# Altium project Bass Debug Board.PrjPcb
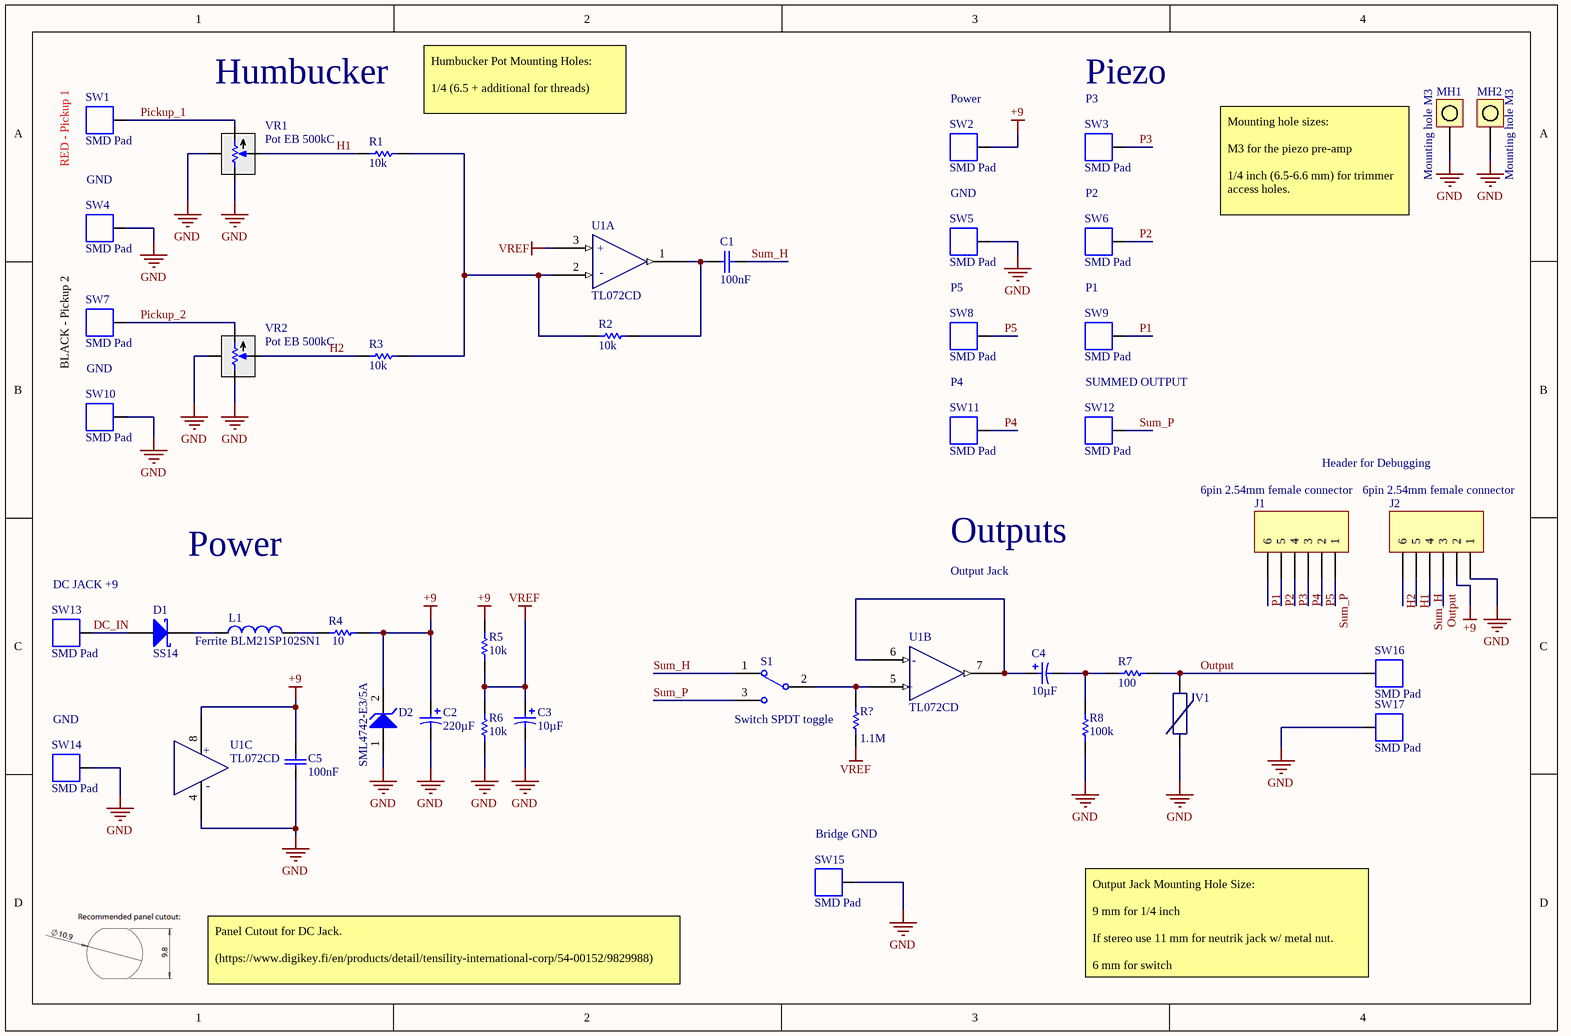
[diagram p0: Bass Debug Board.SchDoc]
1 sheet, 43 parts. Net scope: global (net labels, ports and power ports of the same name join across sheets).
Board file: Bass Debug Board.PcbDoc

## Sheet Bass Debug Board.SchDoc
size A4; SheetNumber: 1; SheetTotal: 1

### Parts
C1  Capacitance: 100nF  [1206-CAP]  (hidden comment: Cap 100nF 1206 C0G)
C2  Capacitance: 220µF  [E-CAP, SMT, diameter 6.3mm, height 7.7mm]  (hidden comment: Cap pol 220µF 16V)
C3  Capacitance: 10µF  [E-CAP, SMT, diameter 4mm, height 5.4mm]  (hidden comment: Cap pol 10µF 16V)
C4  Capacitance: 10µF  [E-CAP, SMT, diameter 5mm, height 5.4mm]  (hidden comment: Cap pol 10µF 35V)
C5  Capacitance: 100nF  [1206-CAP]  (hidden comment: Cap 100nF 1206 C0G)
D1  SS14  [SS14]
D2  SML4742-E3/5A  [DO-214AC]
J1  6pin 2.54mm female connector  [Header 1X6]
J2  6pin 2.54mm female connector  [Header 1X6]
L1  Ferrite BLM21SP102SN1  [0805-IND]
MH1  Mounting hole M3  [Mounting hole M3]  (no BOM)
MH2  Mounting hole M3  [Mounting hole M3]  (no BOM)
R1  Resistance: 10k  [0805-RES]  (hidden comment: Res 10k 1% 0805)
R2  Resistance: 10k  [0805-RES]  (hidden comment: Res 10k 1% 0805)
R3  Resistance: 10k  [0805-RES]  (hidden comment: Res 10k 1% 0805)
R4  Resistance: 10  [0805-RES]  (hidden comment: Res 10R 5% 0805)
R5  Resistance: 10k  [0805-RES]  (hidden comment: Res 10k 1% 0805)
R6  Resistance: 10k  [0805-RES]  (hidden comment: Res 10k 1% 0805)
R7  Resistance: 100  [0805-RES]  (hidden comment: Res 100R 1% 0805)
R8  Resistance: 100k  [0603-RES]  (hidden comment: Res 100k 1% 0603)
R?  Resistance: 1.1M  [0402-RES]  (hidden comment: Res 1.1M 1% 0402)
S1  Switch SPDT toggle  [Switch SPDT]
SW1  SMD Pad  [SMD_pad]
SW2  SMD Pad  [SMD_pad]
SW3  SMD Pad  [SMD_pad]
SW4  SMD Pad  [SMD_pad]
SW5  SMD Pad  [SMD_pad]
SW6  SMD Pad  [SMD_pad]
SW7  SMD Pad  [SMD_pad]
SW8  SMD Pad  [SMD_pad]
SW9  SMD Pad  [SMD_pad]
SW10  SMD Pad  [SMD_pad]
SW11  SMD Pad  [SMD_pad]
SW12  SMD Pad  [SMD_pad]
SW13  SMD Pad  [SMD_pad]
SW14  SMD Pad  [SMD_pad]
SW15  SMD Pad  [SMD_pad]
SW16  SMD Pad  [SMD_pad]
SW17  SMD Pad  [SMD_pad]
U1  TL072CD  [SOIC8-127P600X175-8N]  (parts A,B,C of 3)
V1  Var AVRF101U6R8KT242  [0402 COMPONENT]  (value not drawn)
VR1  Pot EB 500kC  [VB16Z]
VR2  Pot EB 500kC  [VB16Z]

### Nets
+9: C2.1 C5.2 D2.2 J2.2 R4.2 R5.1 SW2.1 U1.8(V+)
GND: C2.2 C3.2 C5.1 D2.1 J2.1 MH1.1 MH2.1 R6.2 R8.2 SW4.1 SW5.1 SW10.1 SW14.1 SW15.1 SW17.1 U1.4(V-) V1.1 VR1.1(CCWPIN) VR1.4 VR2.1(CCWPIN) VR2.4
VREF: C3.1 R5.2 R6.1 R?.2 U1.3(IN+)
DC_IN: D1.A SW13.1
H1: J2.5 R1.1 VR1.2(WIPER)
H2: J2.6 R3.1 VR2.2(WIPER)
Output: J2.3 R7.2 SW16.1 V1.2
P1: J1.6 SW9.1
P2: J1.5 SW6.1
P3: J1.4 SW3.1
P4: J1.3 SW11.1
P5: J1.2 SW8.1
Pickup_1: SW1.1 VR1.3(CWPIN)
Pickup_2: SW7.1 VR2.3(CWPIN)
Sum_H: C1.2 J2.4 S1.1
Sum_P: J1.1 S1.3 SW12.1
NetC1_1: C1.1 R2.2 U1.1(OUT)
NetC4_1: C4.1 U1.6(IN-) U1.7
NetC4_2: C4.2 R7.1 R8.1
NetD1_K: D1.K L1.1
NetL1_2: L1.2 R4.1
NetR1_2: R1.2 R2.1 R3.2 U1.2(IN-)
NetR?_1: R?.1 S1.2 U1.5(IN+)

### Notes on the sheet
- Humbucker
- (near R1) Humbucker Pot Mounting Holes:
  1/4 (6.5 + additional for threads)
- (near SW2) Power
- Piezo
- (near SW3) P3
- (near SW1) RED - Pickup 1
- GND
- P2
- (near MH1) Mounting hole sizes:
  M3 for the piezo pre-amp
  1/4 inch (6.5-6.6 mm) for trimmer access holes.
- P5
- P1
- BLACK - Pickup 2
- P4
- SUMMED OUTPUT
- Header for Debugging
- Power
- Outputs
- Output Jack
- DC JACK +9
- (near SW14) GND
- (near SW15) Bridge GND
- Panel Cutout for DC Jack.
  (https://www.digikey.fi/en/products/detail/tensility-international-corp/54-00152/9829988)
- Output Jack Mounting Hole Size:
  9 mm for 1/4 inch
  If stereo use 11 mm for neutrik jack w/ metal nut.
  6 mm for switch
- (in symbol CMP-028-0012-7, part A) +; -
- (in symbol CMP-028-0012-7, part B) -; +
- (in symbol CMP-028-0012-7, part C) +; -

### Library data of the parts
C1 C5 = CMP-04102-2: Cap 100nF 1206 C0G 50V +-5%; Tolerance (+-): 5%; Dielectric: C0G; Height: 1.8mm; Size (Imperial): 1206; Rated Voltage: 50V; Maximum operating temperature: 125°C
C2 = CMP-00098-4: Cap Aluminum 220uF 16V ±20% (6.3x7.7mm) SMD 2000h 85°C; Lifetime @ Max. Temp. (hours): 2000h; Rated Voltage: 16V; Maximum operating temperature: 85°C; - Tolerance: 20%; + Tolerance: 20%
C3 = CMP-00093-4: Cap Aluminum 10uF 16V ±20% (4x5.4mm) SMD 2000h 85°C; Lifetime @ Max. Temp. (hours): 2000h; + Tolerance: 20%; Rated Voltage: 16V; - Tolerance: 20%; Maximum operating temperature: 85°C
C4 = CMP-00115-4: Cap Aluminum 10uF 35V ±20% (5x5.4mm) SMD 2000h 85°C; + Tolerance: 20%; Lifetime @ Max. Temp. (hours): 2000h; Maximum operating temperature: 85°C; Rated Voltage: 35V; - Tolerance: 20%
D1 = CMP-029-0000-5: ON SEMICONDUCTOR - SS14 - DIODE, SCHOTTKY, 1A, 40V, DO-214AC-2; Manufacturer: ON Semiconductor / Fairchild; Forward Voltage: 500mV; Max Forward Surge Current (Ifsm): 40A; Polarity: Standard; Power Dissipation: 1.1W; Element Configuration: Single; Peak Reverse Current: 200uA; Number of Elements: 1; Average Rectified Current: 1A; ComponentLink2URL: https://datasheet.ciiva.com/8303/ss19-8303766.pdf?src-supplier=Avnet; Source: main.SchLib; Mount: Surface Mount; ComponentLink4URL: https://datasheet.ciiva.com/7965/1766303-7965241.pdf?src-supplier=Element14; Termination: SMD/SMT; Height: 2.2mm; Lead Free: Lead Free; Packaging: Tape and Reel; Max Reverse Voltage (DC): 40V; Voltage Rating (DC): 40V; REACH SVHC: No SVHC; ComponentLink7Description: https://datasheet.ciiva.com/910/ss12-910697.pdf?src-supplier=Digi-Key; Current: 1A; Number of Pins: 2; ComponentLink8Description: https://datasheet.ciiva.com/22651/1880990-22651980.pdf?src-supplier=Element14; Radiation Hardening: No; Case/Package: SMA; ComponentLink1URL: https://datasheet.ciiva.com/4713/ss14-197224-4713938.pdf?src-supplier=Mouser; Number of Terminals: 2; ComponentLink6Description: https://datasheet.ciiva.com/25951/ss19-25951496.pdf?src-supplier=Avnet+Europe; Manufacturer Part Number: SS14; ComponentLink1Description: https://datasheet.ciiva.com/4713/ss14-197224-4713938.pdf?src-supplier=Mouser; Forward Current: 1A; Max Repetitive Reverse Voltage (Vrrm): 40V; ComponentLink3URL: https://datasheet.ciiva.com/910/ss12-910695.pdf?src-supplier=Digi-Key; Max Operating Temperature: 125°C; Output Current: 1A; Peak Non-Repetitive Surge Current: 40A; Stock 1: 302709; ComponentLink6URL: https://datasheet.ciiva.com/25951/ss19-25951496.pdf?src-supplier=Avnet+Europe; ComponentLink2Description: https://datasheet.ciiva.com/8303/ss19-8303766.pdf?src-supplier=Avnet; Current Rating: 1A; ComponentLink3Description: https://datasheet.ciiva.com/910/ss12-910695.pdf?src-supplier=Digi-Key; Voltage: 40V; ComponentLink8URL: https://datasheet.ciiva.com/22651/1880990-22651980.pdf?src-supplier=Element14; Pricing 1: 1 = 0,42000, 10 = 0,29400, 50 = 0,29400, 100 = 0,13500, 1000 = 0,10400, 10000 = 0,08100 (USD); ComponentLink4Description: https://datasheet.ciiva.com/7965/1766303-7965241.pdf?src-supplier=Element14; Length: 4.75mm; ComponentLink7URL: https://datasheet.ciiva.com/910/ss12-910697.pdf?src-supplier=Digi-Key; Min Operating Temperature: -65°C; Max Power Dissipation: 1.1W; Design Item ID: SS14; ComponentLink5URL: https://datasheet.ciiva.com/910/ss12-910696.pdf?src-supplier=Digi-Key; Width: 2.95mm; RoHS: Yes; ComponentLink5Description: https://datasheet.ciiva.com/910/ss12-910696.pdf?src-supplier=Digi-Key; Weight: 0.003739oz; Package Quantity: 7500
D2 = CMP-029-0015-3: 12V Zener; Manufacturer: Vishay Semiconductors; Impedance: 9R; Power Dissipation: 1W; Tolerance: 10%; Element Configuration: Single; Max Reverse Leakage Current: 5uA; ComponentLink3Description: http://www.vishay.com/docs/85782/sml4728.pdf?src-supplier=Avnet; Package Quantity: 7500; Source: main.SchLib; ComponentLink2Description: http://www.mouser.com/ds/2/427/sml4728-67952.pdf?src-supplier=Mouser; Manufacturer Part Number: SML4742-E3/5A; Mount: Surface Mount; RoHS: Yes; Max Power Dissipation: 1W; Number of Pins: 2; ComponentLink1URL: https://media.digikey.com/pdf/Data%20Sheets/Vishay%20Siliconix%20PDFs/SML4728-SML4764A.pdf?src-supplier=Digi-Key; Radiation Hardening: No; ComponentLink1Description: https://media.digikey.com/pdf/Data%20Sheets/Vishay%20Siliconix%20PDFs/SML4728-SML4764A.pdf?src-supplier=Digi-Key; Stock 1: 7485; ComponentLink2URL: http://www.mouser.com/ds/2/427/sml4728-67952.pdf?src-supplier=Mouser; Packaging: Tape and Reel; Voltage Tolerance: 10%; Min Operating Temperature: -65°C; Pricing 1: 1 = 0,50000, 10 = 0,42600, 25 = 0,39760, 100 = 0,31800, 250 = 0,29524, 500 = 0,24982, 1000 = 0,19305, 2500 = 0,17602 (USD); Case/Package: SMA; Design Item ID: SML4742-E3/5A; Zener Voltage: 12V; Mouser part: 78-SML4742-E3/5A; ComponentLink3URL: http://www.vishay.com/docs/85782/sml4728.pdf?src-supplier=Avnet; Max Operating Temperature: 150°C
J1 J2 = CMP-026-0027-1: Board Connector, 6 Contact(s), 1 Row(s), Female, Straight, 0.1 inch Pitch, Solder Terminal, Black Insulator, Socket; Number Of PCB Rows: 1; Contact Style: SQ PIN-SKT; Reference Standard: UL; PCB Contact Pattern: RECTANGULAR; IEC Conformance: No; Insulation Resistance: 5GR; Body Depth: 0.325inch; Number of Contacts: 6; Reliability: COMMERCIAL; Rated Current (Signal): 2A; Body Length: 0.6inch; Option: General Purpose; Dielectric Withstanding Voltage (AC): 2.1kV; Additional Feature: 3M; Contact Gender: Female; Number Of Connectors: 1; Contact Finish - Mating: MATTE TIN OVER NICKEL (100); Mounting Style: STRAIGHT; Max Operating Temperature: 105°C; REACH SVHC: Yes; Contact Finish - Termination: MATTE TIN OVER NICKEL (100); Mixed Contacts: No; Min Operating Temperature: -40°C; JESD-609 Code: e3; RoHS Compliant: Yes; Mount: Board; Insulation Material: Nylon; Body Breadth: 0.1inch; Mating Contact Pitch: 0.1inch; Filter Feature: No; Number of Rows Loaded: 1; Body/Shell Style: SOCKET; Insulation Color: Black; Flammability Rating: UL94 V-0; Connector Type: BOARD CONNECTOR; DIN Conformance: No; MIL Conformance: No; Terminal Length: 0.125inch; Contact Pattern: RECTANGULAR; Terminal Pitch: 2.54mm; Termination: Solder; Contact Material: Copper Alloy
L1 = CMP-027-0002-5: Ferrite Beads Multi-Layer High Current 1KOhm 25% 100MHz 1.6A 0.12Ohm DCR; Manufacturer Part Number: BLM21SP102SN1D; Manufacturer: Murata; Pricing 1: 1=0,29000, 10=0,17400, 100=0,12300, 500=0,10600, 1000=0,09400, 4000=0,08000 (USD); Stock 1: 10289; RoHS: No; Source: jimi.SchLib; Design Item ID: Ferrite BLM21SP102SN1
MH1 MH2 = CMP-021-0014-4: 3.2 mm mounting hole for M3 screw; Design Item ID: Mounting hole M3; Source: jimi.SchLib
R1-R3 = CMP-02586-2: Resistor 10k +-1% 0805 Thin film 0.125W +-50ppm/°C; Power: 125mW; Maximum working voltage: 150V; Temperature Coefficient (ppm/°C): 50; Size (Imperial): 0805; Tolerance (+-): 1%; Composition: Thin film
R4 = CMP-04716-2: Resistor 10R +-5% 0805 Thick film 0.125W +-200ppm/°C; Temperature Coefficient (ppm/°C): 200; Power: 125mW; Maximum working voltage: 150V; Tolerance (+-): 5%; Size (Imperial): 0805; Composition: Thick film
R5 R6 = CMP-07009-1: Resistor 10k +-1% 0805 Thick film 0.125W +- 100ppm/°C; Temperature Coefficient (ppm/°C): 100; Maximum working voltage: 150V; Power: 125mW; Tolerance (+-): 1%; Size (Imperial): 0805; Composition: Thick film
R7 = CMP-02362-2: Resistor 100R +-1% 0805 Thin film 0.125W +-50ppm/°C; Temperature Coefficient (ppm/°C): 50; Power: 125mW; Maximum working voltage: 150V; Composition: Thin film; Size (Imperial): 0805; Tolerance (+-): 1%
R8 = CMP-03428-2: Resistor 100k +-1% 0603 Thin film 0.1W +-50ppm/°C; Power: 100mW; Maximum working voltage: 75V; Temperature Coefficient (ppm/°C): 50; Composition: Thin film; Size (Imperial): 0603; Tolerance (+-): 1%
R? = CMP-05639-1: Resistor 1.1M +-1% 0402 Thick film 0.063W +- 100ppm/°C; Temperature Coefficient (ppm/°C): 100; Maximum working voltage: 50V; Power: 63mW; Tolerance (+-): 1%; Size (Imperial): 0402; Composition: Thick film
S1 = CMP-028-0103-4: SPDT toggle switch; Darkglass part: D00-0023; Supplied by Darkglass: Yes; Design Item ID: Switch SPDT toggle; Selective Soldering: Yes; Source: main.SchLib
SW1-SW17 = CMP-047-0000-3: Source: Schlib.SchLib; Design Item ID: SMD Pad
U1 = CMP-028-0012-7: Operational Amplifiers - Op Amps Dual Low Noise JFET SOIC8; Manufacturer 1: Texas Instruments; Operating Supply Voltage: 18V; Number of Elements: 2; Bandwidth: 3MHz; Dual Supply Voltage: 9V; Input Bias Current: 200pA; Min Dual Supply Voltage: 3.5V; Voltage Gain: 106.02dB; Max I/O Voltage: 10mV; Common Mode Rejection Ratio: 70dB; Input Offset Voltage (Vos): 3mV; Slew Rate: 13V/µs; Operating Supply Current: 1.4mA; Nominal Supply Current: 5mA; ComponentLink4URL: http://www.farnell.com/datasheets/1862384.pdf?src-supplier=Element14; ComponentLink4Description: http://www.farnell.com/datasheets/1862384.pdf?src-supplier=Element14; Manufacturer Part Number 1: TL072CD; REACH SVHC: No SVHC; Pricing 1: 1 = 0.71000, 10 = 0.59500, 50 = 0.59500, 100 = 0.38400, 1000 = 0.30700, 10000 = 0.25000 (USD); RoHS: Yes; Source: main.SchLib; ComponentLink1URL: http://www.ti.com/general/docs/lit/getliterature.tsp?genericPartNumber=TL072&&fileType=pdf&src-supplier=Avnet; Height: 1.58mm; Gain Bandwidth Product: 3MHz; ComponentLink5URL: http://focus.ti.com/lit/ds/symlink/tl074.pdf?src-supplier=Avnet+Asia; Number of Amplifiers: 2; ComponentLink2Description: https://www.distrelec.biz/Web/Downloads/_t/ds/tl07x-series_eng_tds.pdf?mime=application%2Fpdf&src-supplier=Distrelec; Radiation Hardening: No; ComponentLink3URL: http://www.ti.com/lit/ds/symlink/tl071a.pdf?src-supplier=Digi-Key; Unity Gain Bandwidth Product: 3MHz; Case/Package: D; Max Operating Temperature: 85°C; Packaging: Rail/Tube; Number of Circuits: 2; Number of Pins: 8; Length: 4.9mm; Number of Channels: 2; Package Quantity: 75; Min Operating Temperature: -40°C; Width: 3.91mm; Lead Free: Lead Free; Stock 1: 14514; ComponentLink3Description: http://www.ti.com/lit/ds/symlink/tl071a.pdf?src-supplier=Digi-Key; Nominal Gain Bandwidth Product: 3MHz; ComponentLink5Description: http://focus.ti.com/lit/ds/symlink/tl074.pdf?src-supplier=Avnet+Asia; Max Dual Supply Voltage: 18V; ComponentLink1Description: http://www.ti.com/general/docs/lit/getliterature.tsp?genericPartNumber=TL072&&fileType=pdf&src-supplier=Avnet; ComponentLink2URL: https://www.distrelec.biz/Web/Downloads/_t/ds/tl07x-series_eng_tds.pdf?mime=application%2Fpdf&src-supplier=Distrelec; Design Item ID: TL072CD; PartId: 1
V1 = CMP-021-0016-3: Varistor 0402 28VDC 6.8pF 10% Audio Line; Manufacturer: TDK; RoHS: No; Stock 1: 19800; Source: jimi.SchLib; Pricing 1: 1=0,37000, 10=0,34800, 100=0,12200, 500=0,10400, 1000=0,07100, 2500=0,05900 (USD); Design Item ID: Var AVRF101U6R8KT242; Manufacturer Part Number: AVRF101U6R8KT242
VR1 VR2 = CMP-048-0004-4: LC001W, F grease - drawing 887-1241; Supplied by Darkglass: YES; Selective Soldering: YES; Source: Schlib.SchLib; Design Item ID: Pot EB 500kC